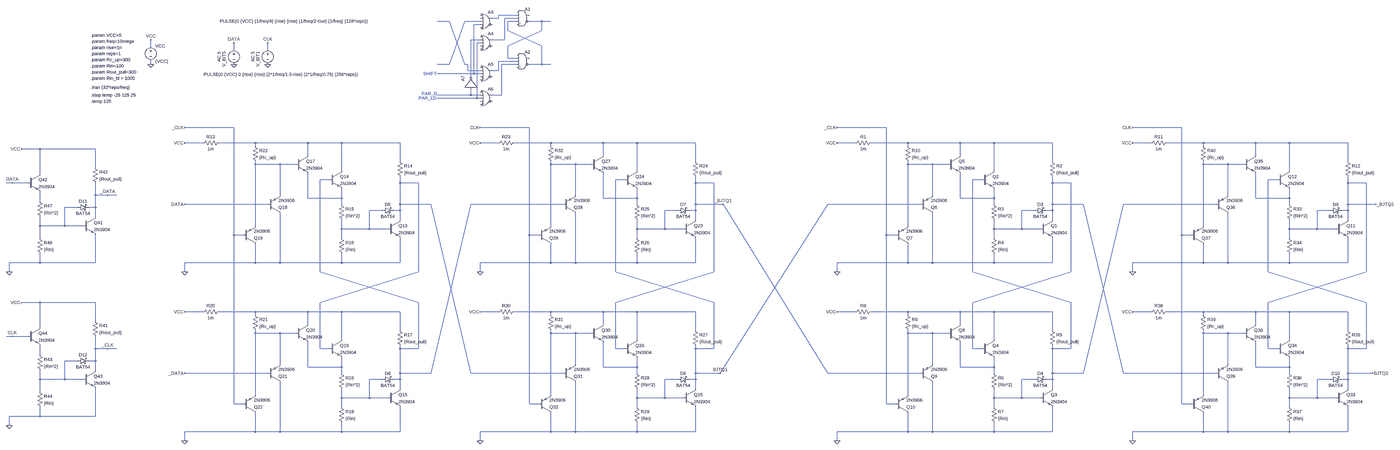
[diagram p0: schematic d_flop_bjt.asc, whole sheet]
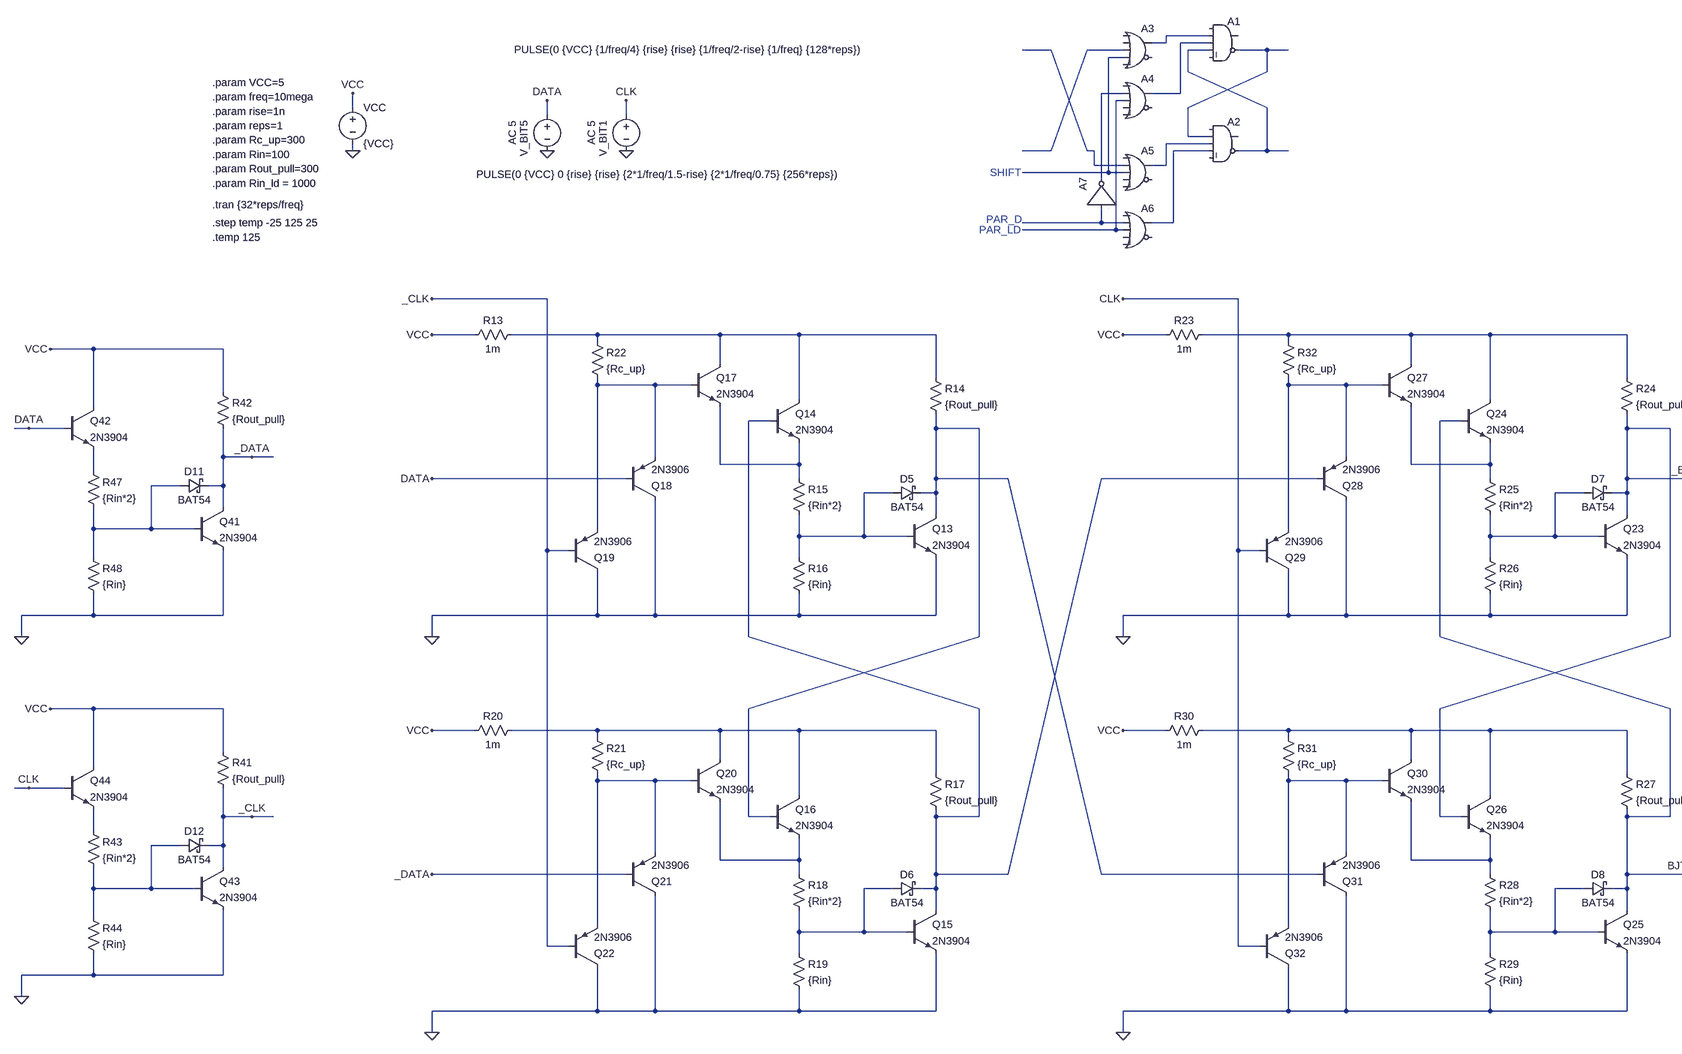
[diagram p1: schematic d_flop_bjt.asc, part, row 1 of 1, column 1 of 2]
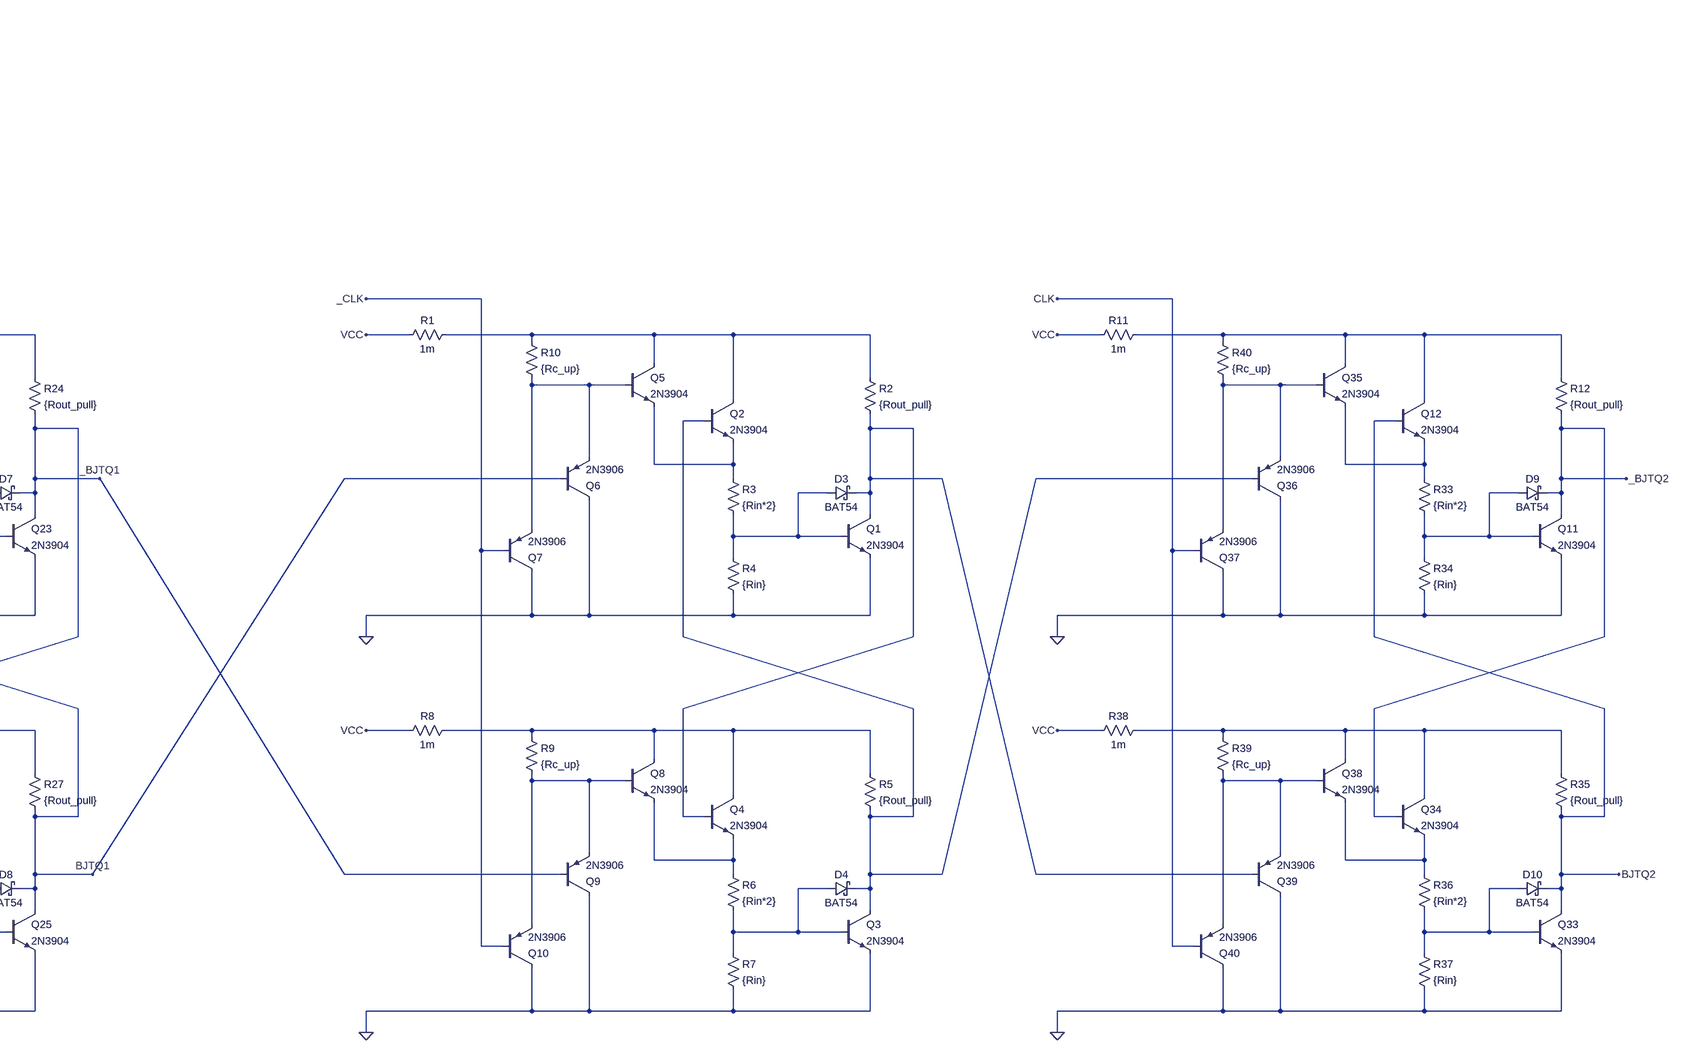
[diagram p2: schematic d_flop_bjt.asc, part, row 1 of 1, column 2 of 2]
d_flop_bjt.asc, the LTspice schematic file:
Version 4
SHEET 1 37460 9492
WIRE -480 5904 -576 5904
WIRE -576 5920 -576 5904
WIRE -576 5920 -608 5920
WIRE -480 5920 -544 5920
WIRE -832 5936 -896 5936
WIRE -672 5936 -752 5936
WIRE -480 5936 -528 5936
WIRE -352 5936 -416 5936
WIRE -304 5936 -352 5936
WIRE -672 5952 -704 5952
WIRE -528 5984 -528 5936
WIRE -352 5984 -352 5936
WIRE -672 6032 -720 6032
WIRE -544 6032 -544 5920
WIRE -544 6032 -608 6032
WIRE -672 6048 -688 6048
WIRE -2384 6064 -2384 6032
WIRE -528 6064 -352 5984
WIRE -352 6064 -528 5984
WIRE -1952 6080 -1952 6048
WIRE -1776 6080 -1776 6048
WIRE -528 6128 -528 6064
WIRE -480 6128 -528 6128
WIRE -480 6144 -576 6144
WIRE -2384 6160 -2384 6144
WIRE -832 6160 -752 5936
WIRE -832 6160 -896 6160
WIRE -752 6160 -832 5936
WIRE -736 6160 -752 6160
WIRE -480 6160 -560 6160
WIRE -352 6160 -352 6064
WIRE -352 6160 -416 6160
WIRE -304 6160 -352 6160
WIRE -736 6192 -736 6160
WIRE -672 6192 -736 6192
WIRE -576 6192 -576 6144
WIRE -576 6192 -608 6192
WIRE -704 6208 -704 5952
WIRE -704 6208 -896 6208
WIRE -672 6208 -704 6208
WIRE -720 6224 -720 6032
WIRE -720 6320 -720 6288
WIRE -720 6320 -896 6320
WIRE -672 6320 -720 6320
WIRE -560 6320 -560 6160
WIRE -560 6320 -608 6320
WIRE -688 6336 -688 6048
WIRE -688 6336 -896 6336
WIRE -672 6336 -688 6336
WIRE -1952 6784 -2208 6784
WIRE -416 6784 -672 6784
WIRE 1440 6784 1184 6784
WIRE 2976 6784 2720 6784
WIRE -2112 6864 -2208 6864
WIRE -1840 6864 -2032 6864
WIRE -1568 6864 -1840 6864
WIRE -1392 6864 -1568 6864
WIRE -1088 6864 -1392 6864
WIRE -576 6864 -672 6864
WIRE -304 6864 -496 6864
WIRE -32 6864 -304 6864
WIRE 144 6864 -32 6864
WIRE 448 6864 144 6864
WIRE 1280 6864 1184 6864
WIRE 1552 6864 1360 6864
WIRE 1824 6864 1552 6864
WIRE 2000 6864 1824 6864
WIRE 2304 6864 2000 6864
WIRE 2816 6864 2720 6864
WIRE 3088 6864 2896 6864
WIRE 3360 6864 3088 6864
WIRE 3536 6864 3360 6864
WIRE 3840 6864 3536 6864
WIRE -1840 6880 -1840 6864
WIRE -304 6880 -304 6864
WIRE 1552 6880 1552 6864
WIRE 3088 6880 3088 6864
WIRE -2960 6896 -3056 6896
WIRE -2672 6896 -2960 6896
WIRE -1568 6928 -1568 6864
WIRE -32 6928 -32 6864
WIRE 1824 6928 1824 6864
WIRE 3360 6928 3360 6864
WIRE -1088 6960 -1088 6864
WIRE 448 6960 448 6864
WIRE 2304 6960 2304 6864
WIRE 3840 6960 3840 6864
WIRE -1840 6976 -1840 6960
WIRE -1712 6976 -1840 6976
WIRE -1632 6976 -1712 6976
WIRE -304 6976 -304 6960
WIRE -176 6976 -304 6976
WIRE -96 6976 -176 6976
WIRE 1552 6976 1552 6960
WIRE 1680 6976 1552 6976
WIRE 1760 6976 1680 6976
WIRE 3088 6976 3088 6960
WIRE 3216 6976 3088 6976
WIRE 3296 6976 3216 6976
WIRE -2672 6992 -2672 6896
WIRE -1392 7008 -1392 6864
WIRE 144 7008 144 6864
WIRE 2000 7008 2000 6864
WIRE 3536 7008 3536 6864
WIRE -2960 7024 -2960 6896
WIRE -1456 7056 -1504 7056
WIRE 80 7056 32 7056
WIRE 1936 7056 1888 7056
WIRE 3472 7056 3424 7056
WIRE -3104 7072 -3136 7072
WIRE -3024 7072 -3104 7072
WIRE -1088 7072 -1088 7040
WIRE -992 7072 -1088 7072
WIRE 448 7072 448 7040
WIRE 544 7072 448 7072
WIRE 2304 7072 2304 7040
WIRE 2400 7072 2304 7072
WIRE 3840 7072 3840 7040
WIRE 3936 7072 3840 7072
WIRE -2672 7136 -2672 7072
WIRE -2608 7136 -2672 7136
WIRE -2560 7136 -2608 7136
WIRE -1712 7136 -1712 6976
WIRE -176 7136 -176 6976
WIRE 1680 7136 1680 6976
WIRE 3216 7136 3216 6976
WIRE -1568 7152 -1568 7024
WIRE -1392 7152 -1392 7104
WIRE -1392 7152 -1568 7152
WIRE -32 7152 -32 7024
WIRE 144 7152 144 7104
WIRE 144 7152 -32 7152
WIRE 1824 7152 1824 7024
WIRE 2000 7152 2000 7104
WIRE 2000 7152 1824 7152
WIRE 3360 7152 3360 7024
WIRE 3536 7152 3536 7104
WIRE 3536 7152 3360 7152
WIRE -2960 7168 -2960 7120
WIRE -1776 7184 -2208 7184
WIRE -1392 7184 -1392 7152
WIRE -1088 7184 -1088 7072
WIRE -928 7184 -1088 7184
WIRE -240 7184 -720 7184
WIRE 144 7184 144 7152
WIRE 448 7184 448 7072
WIRE 592 7184 448 7184
WIRE 1616 7184 1136 7184
WIRE 2000 7184 2000 7152
WIRE 2304 7184 2304 7072
WIRE 2464 7184 2304 7184
WIRE 3152 7184 2672 7184
WIRE 3536 7184 3536 7152
WIRE 3840 7184 3840 7072
WIRE 3984 7184 3840 7184
WIRE -2768 7200 -2832 7200
WIRE -2672 7200 -2672 7136
WIRE -2672 7200 -2704 7200
WIRE -1184 7216 -1248 7216
WIRE -1088 7216 -1088 7184
WIRE -1088 7216 -1120 7216
WIRE 352 7216 288 7216
WIRE 448 7216 448 7184
WIRE 448 7216 416 7216
WIRE 2208 7216 2144 7216
WIRE 2304 7216 2304 7184
WIRE 2304 7216 2272 7216
WIRE 3744 7216 3680 7216
WIRE 3840 7216 3840 7184
WIRE 3840 7216 3808 7216
WIRE -2672 7248 -2672 7200
WIRE -1088 7264 -1088 7216
WIRE 448 7264 448 7216
WIRE 2304 7264 2304 7216
WIRE 3840 7264 3840 7216
WIRE -2960 7296 -2960 7248
WIRE -2832 7296 -2832 7200
WIRE -2832 7296 -2960 7296
WIRE -2736 7296 -2832 7296
WIRE -1840 7296 -1840 6976
WIRE -304 7296 -304 6976
WIRE 1552 7296 1552 6976
WIRE 3088 7296 3088 6976
WIRE -1392 7312 -1392 7264
WIRE -1248 7312 -1248 7216
WIRE -1248 7312 -1392 7312
WIRE -1152 7312 -1248 7312
WIRE 144 7312 144 7264
WIRE 288 7312 288 7216
WIRE 288 7312 144 7312
WIRE 384 7312 288 7312
WIRE 2000 7312 2000 7264
WIRE 2144 7312 2144 7216
WIRE 2144 7312 2000 7312
WIRE 2240 7312 2144 7312
WIRE 3536 7312 3536 7264
WIRE 3680 7312 3680 7216
WIRE 3680 7312 3536 7312
WIRE 3776 7312 3680 7312
WIRE -1952 7344 -1952 6784
WIRE -1904 7344 -1952 7344
WIRE -416 7344 -416 6784
WIRE -368 7344 -416 7344
WIRE 1440 7344 1440 6784
WIRE 1488 7344 1440 7344
WIRE 2976 7344 2976 6784
WIRE 3024 7344 2976 7344
WIRE -2960 7360 -2960 7296
WIRE -1392 7360 -1392 7312
WIRE 144 7360 144 7312
WIRE 2000 7360 2000 7312
WIRE 3536 7360 3536 7312
WIRE -2960 7488 -2960 7440
WIRE -2960 7488 -3120 7488
WIRE -2672 7488 -2672 7344
WIRE -2672 7488 -2960 7488
WIRE -1840 7488 -1840 7392
WIRE -1840 7488 -2208 7488
WIRE -1712 7488 -1712 7232
WIRE -1712 7488 -1840 7488
WIRE -1392 7488 -1392 7440
WIRE -1392 7488 -1712 7488
WIRE -1088 7488 -1088 7360
WIRE -1088 7488 -1392 7488
WIRE -304 7488 -304 7392
WIRE -304 7488 -672 7488
WIRE -176 7488 -176 7232
WIRE -176 7488 -304 7488
WIRE 144 7488 144 7440
WIRE 144 7488 -176 7488
WIRE 448 7488 448 7360
WIRE 448 7488 144 7488
WIRE 1552 7488 1552 7392
WIRE 1552 7488 1184 7488
WIRE 1680 7488 1680 7232
WIRE 1680 7488 1552 7488
WIRE 2000 7488 2000 7440
WIRE 2000 7488 1680 7488
WIRE 2304 7488 2304 7360
WIRE 2304 7488 2000 7488
WIRE 3088 7488 3088 7392
WIRE 3088 7488 2720 7488
WIRE 3216 7488 3216 7232
WIRE 3216 7488 3088 7488
WIRE 3536 7488 3536 7440
WIRE 3536 7488 3216 7488
WIRE 3840 7488 3840 7360
WIRE 3840 7488 3536 7488
WIRE -3120 7536 -3120 7488
WIRE -2208 7536 -2208 7488
WIRE -1504 7536 -1504 7056
WIRE -992 7536 -992 7072
WIRE -672 7536 -672 7488
WIRE 32 7536 32 7056
WIRE 544 7536 544 7072
WIRE 1184 7536 1184 7488
WIRE 1888 7536 1888 7056
WIRE 2400 7536 2400 7072
WIRE 2720 7536 2720 7488
WIRE 3424 7536 3424 7056
WIRE 3936 7536 3936 7072
WIRE -2960 7696 -3056 7696
WIRE -2672 7696 -2960 7696
WIRE -1504 7696 -992 7536
WIRE -992 7696 -1504 7536
WIRE 32 7696 544 7536
WIRE 544 7696 32 7536
WIRE 1888 7696 2400 7536
WIRE 2400 7696 1888 7536
WIRE 3424 7696 3936 7536
WIRE 3936 7696 3424 7536
WIRE -2112 7744 -2208 7744
WIRE -1840 7744 -2032 7744
WIRE -1568 7744 -1840 7744
WIRE -1392 7744 -1568 7744
WIRE -1088 7744 -1392 7744
WIRE -576 7744 -672 7744
WIRE -304 7744 -496 7744
WIRE -32 7744 -304 7744
WIRE 144 7744 -32 7744
WIRE 448 7744 144 7744
WIRE 1280 7744 1184 7744
WIRE 1552 7744 1360 7744
WIRE 1824 7744 1552 7744
WIRE 2000 7744 1824 7744
WIRE 2304 7744 2000 7744
WIRE 2816 7744 2720 7744
WIRE 3088 7744 2896 7744
WIRE 3360 7744 3088 7744
WIRE 3536 7744 3360 7744
WIRE 3840 7744 3536 7744
WIRE -1840 7760 -1840 7744
WIRE -304 7760 -304 7744
WIRE 1552 7760 1552 7744
WIRE 3088 7760 3088 7744
WIRE -2672 7792 -2672 7696
WIRE -1568 7808 -1568 7744
WIRE -32 7808 -32 7744
WIRE 1824 7808 1824 7744
WIRE 3360 7808 3360 7744
WIRE -2960 7824 -2960 7696
WIRE -1088 7840 -1088 7744
WIRE 448 7840 448 7744
WIRE 2304 7840 2304 7744
WIRE 3840 7840 3840 7744
WIRE -1840 7856 -1840 7840
WIRE -1712 7856 -1840 7856
WIRE -1632 7856 -1712 7856
WIRE -304 7856 -304 7840
WIRE -176 7856 -304 7856
WIRE -96 7856 -176 7856
WIRE 1552 7856 1552 7840
WIRE 1680 7856 1552 7856
WIRE 1760 7856 1680 7856
WIRE 3088 7856 3088 7840
WIRE 3216 7856 3088 7856
WIRE 3296 7856 3216 7856
WIRE -3104 7872 -3136 7872
WIRE -3024 7872 -3104 7872
WIRE -1392 7888 -1392 7744
WIRE 144 7888 144 7744
WIRE 2000 7888 2000 7744
WIRE 3536 7888 3536 7744
WIRE -2672 7936 -2672 7872
WIRE -2608 7936 -2672 7936
WIRE -2560 7936 -2608 7936
WIRE -1504 7936 -1504 7696
WIRE -1456 7936 -1504 7936
WIRE -1088 7936 -1088 7920
WIRE -992 7936 -992 7696
WIRE -992 7936 -1088 7936
WIRE 32 7936 32 7696
WIRE 80 7936 32 7936
WIRE 448 7936 448 7920
WIRE 544 7936 544 7696
WIRE 544 7936 448 7936
WIRE 1888 7936 1888 7696
WIRE 1936 7936 1888 7936
WIRE 2304 7936 2304 7920
WIRE 2400 7936 2400 7696
WIRE 2400 7936 2304 7936
WIRE 3424 7936 3424 7696
WIRE 3472 7936 3424 7936
WIRE 3840 7936 3840 7920
WIRE 3936 7936 3936 7696
WIRE 3936 7936 3840 7936
WIRE -2960 7968 -2960 7920
WIRE -2768 8000 -2832 8000
WIRE -2672 8000 -2672 7936
WIRE -2672 8000 -2704 8000
WIRE -1712 8016 -1712 7856
WIRE -176 8016 -176 7856
WIRE 1680 8016 1680 7856
WIRE 3216 8016 3216 7856
WIRE -1568 8032 -1568 7904
WIRE -1392 8032 -1392 7984
WIRE -1392 8032 -1568 8032
WIRE -32 8032 -32 7904
WIRE 144 8032 144 7984
WIRE 144 8032 -32 8032
WIRE 1824 8032 1824 7904
WIRE 2000 8032 2000 7984
WIRE 2000 8032 1824 8032
WIRE 3360 8032 3360 7904
WIRE 3536 8032 3536 7984
WIRE 3536 8032 3360 8032
WIRE -2672 8048 -2672 8000
WIRE -1776 8064 -2208 8064
WIRE -1392 8064 -1392 8032
WIRE -1088 8064 -1088 7936
WIRE -928 8064 -720 7184
WIRE -928 8064 -1088 8064
WIRE -720 8064 -928 7184
WIRE -240 8064 -720 8064
WIRE 144 8064 144 8032
WIRE 448 8064 448 7936
WIRE 576 8064 1136 7184
WIRE 576 8064 448 8064
WIRE 1136 8064 592 7184
WIRE 1616 8064 1136 8064
WIRE 2000 8064 2000 8032
WIRE 2304 8064 2304 7936
WIRE 2464 8064 2672 7184
WIRE 2464 8064 2304 8064
WIRE 2672 8064 2464 7184
WIRE 3152 8064 2672 8064
WIRE 3536 8064 3536 8032
WIRE 3840 8064 3840 7936
WIRE 3968 8064 3840 8064
WIRE -2960 8096 -2960 8048
WIRE -2832 8096 -2832 8000
WIRE -2832 8096 -2960 8096
WIRE -2736 8096 -2832 8096
WIRE -1184 8096 -1248 8096
WIRE -1088 8096 -1088 8064
WIRE -1088 8096 -1120 8096
WIRE 352 8096 288 8096
WIRE 448 8096 448 8064
WIRE 448 8096 416 8096
WIRE 2208 8096 2144 8096
WIRE 2304 8096 2304 8064
WIRE 2304 8096 2272 8096
WIRE 3744 8096 3680 8096
WIRE 3840 8096 3840 8064
WIRE 3840 8096 3808 8096
WIRE -1088 8144 -1088 8096
WIRE 448 8144 448 8096
WIRE 2304 8144 2304 8096
WIRE 3840 8144 3840 8096
WIRE -2960 8160 -2960 8096
WIRE -1840 8176 -1840 7856
WIRE -304 8176 -304 7856
WIRE 1552 8176 1552 7856
WIRE 3088 8176 3088 7856
WIRE -1392 8192 -1392 8144
WIRE -1248 8192 -1248 8096
WIRE -1248 8192 -1392 8192
WIRE -1152 8192 -1248 8192
WIRE 144 8192 144 8144
WIRE 288 8192 288 8096
WIRE 288 8192 144 8192
WIRE 384 8192 288 8192
WIRE 2000 8192 2000 8144
WIRE 2144 8192 2144 8096
WIRE 2144 8192 2000 8192
WIRE 2240 8192 2144 8192
WIRE 3536 8192 3536 8144
WIRE 3680 8192 3680 8096
WIRE 3680 8192 3536 8192
WIRE 3776 8192 3680 8192
WIRE -1952 8224 -1952 7344
WIRE -1904 8224 -1952 8224
WIRE -416 8224 -416 7344
WIRE -368 8224 -416 8224
WIRE 1440 8224 1440 7344
WIRE 1488 8224 1440 8224
WIRE 2976 8224 2976 7344
WIRE 3024 8224 2976 8224
WIRE -1392 8240 -1392 8192
WIRE 144 8240 144 8192
WIRE 2000 8240 2000 8192
WIRE 3536 8240 3536 8192
WIRE -2960 8288 -2960 8240
WIRE -2960 8288 -3120 8288
WIRE -2672 8288 -2672 8144
WIRE -2672 8288 -2960 8288
WIRE -3120 8336 -3120 8288
WIRE -1840 8368 -1840 8272
WIRE -1840 8368 -2208 8368
WIRE -1712 8368 -1712 8112
WIRE -1712 8368 -1840 8368
WIRE -1392 8368 -1392 8320
WIRE -1392 8368 -1712 8368
WIRE -1088 8368 -1088 8240
WIRE -1088 8368 -1392 8368
WIRE -304 8368 -304 8272
WIRE -304 8368 -672 8368
WIRE -176 8368 -176 8112
WIRE -176 8368 -304 8368
WIRE 144 8368 144 8320
WIRE 144 8368 -176 8368
WIRE 448 8368 448 8240
WIRE 448 8368 144 8368
WIRE 1552 8368 1552 8272
WIRE 1552 8368 1184 8368
WIRE 1680 8368 1680 8112
WIRE 1680 8368 1552 8368
WIRE 2000 8368 2000 8320
WIRE 2000 8368 1680 8368
WIRE 2304 8368 2304 8240
WIRE 2304 8368 2000 8368
WIRE 3088 8368 3088 8272
WIRE 3088 8368 2720 8368
WIRE 3216 8368 3216 8112
WIRE 3216 8368 3088 8368
WIRE 3536 8368 3536 8320
WIRE 3536 8368 3216 8368
WIRE 3840 8368 3840 8240
WIRE 3840 8368 3536 8368
WIRE -2208 8416 -2208 8368
WIRE -672 8416 -672 8368
WIRE 1184 8416 1184 8368
WIRE 2720 8416 2720 8368
FLAG -2384 6160 0
FLAG -2384 6032 VCC
FLAG -1952 6160 0
FLAG -1952 6048 DATA
FLAG -1776 6160 0
FLAG -1776 6048 CLK
FLAG -2208 7536 0
FLAG -2208 6864 VCC
FLAG -2208 8416 0
FLAG -2208 7744 VCC
FLAG -2208 8064 _DATA
FLAG -2208 7184 DATA
FLAG -2208 6784 _CLK
FLAG -672 7536 0
FLAG -672 6864 VCC
FLAG -672 8416 0
FLAG -672 7744 VCC
FLAG -672 6784 CLK
FLAG 576 8064 BJTQ1
FLAG 592 7184 _BJTQ1
FLAG 1184 7536 0
FLAG 1184 6864 VCC
FLAG 1184 8416 0
FLAG 1184 7744 VCC
FLAG 1184 6784 _CLK
FLAG 2720 7536 0
FLAG 2720 6864 VCC
FLAG 2720 8416 0
FLAG 2720 7744 VCC
FLAG 2720 6784 CLK
FLAG 3968 8064 BJTQ2
FLAG 3984 7184 _BJTQ2
FLAG -3120 7536 0
FLAG -3104 7072 DATA
FLAG -3056 6896 VCC
FLAG -2608 7136 _DATA
FLAG -3120 8336 0
FLAG -3104 7872 CLK
FLAG -3056 7696 VCC
FLAG -2608 7936 _CLK
SYMBOL voltage -2384 6048 R0
WINDOW 123 0 0 Left 0
WINDOW 39 0 0 Left 0
SYMATTR InstName VCC
SYMATTR Value {VCC}
SYMBOL voltage -1952 6064 R0
WINDOW 123 -77 30 VRight 2
WINDOW 39 0 0 Left 0
WINDOW 0 -51 28 VRight 2
WINDOW 3 647 148 Right 2
SYMATTR Value2 AC 5
SYMATTR InstName V_BIT5
SYMATTR Value PULSE(0 {VCC} 0 {rise} {rise} {2*1/freq/1.5-rise} {2*1/freq/0.75} {256*reps})
SYMBOL Digital\\and -448 5856 R0
SYMATTR InstName A1
SYMBOL Digital\\and -448 6080 R0
SYMATTR InstName A2
SYMBOL Digital\\or -640 5872 R0
SYMATTR InstName A3
SYMBOL Digital\\or -640 5984 R0
SYMATTR InstName A4
SYMBOL Digital\\or -640 6144 R0
SYMATTR InstName A5
SYMBOL Digital\\or -640 6272 R0
SYMATTR InstName A6
SYMBOL Digital\\inv -784 6288 R270
SYMATTR InstName A7
SYMBOL voltage -1776 6064 R0
WINDOW 123 -77 30 VRight 2
WINDOW 39 0 0 Left 0
WINDOW 0 -51 28 VRight 2
WINDOW 3 521 -129 Right 2
SYMATTR Value2 AC 5
SYMATTR InstName V_BIT1
SYMATTR Value PULSE(0 {VCC} {1/freq/4} {rise} {rise} {1/freq/2-rise} {1/freq} {128*reps})
SYMBOL npn -1152 7264 R0
SYMATTR InstName Q13
SYMATTR Value 2N3904
SYMBOL schottky -1184 7232 R270
WINDOW 0 32 32 VTop 2
WINDOW 3 0 32 VBottom 2
SYMATTR InstName D5
SYMATTR Value BAT54
SYMATTR Description Diode
SYMATTR Type diode
SYMBOL res -2128 6880 R270
WINDOW 0 32 56 VTop 2
WINDOW 3 0 56 VBottom 2
SYMATTR InstName R13
SYMATTR Value 1m
SYMBOL npn -1456 7008 R0
SYMATTR InstName Q14
SYMATTR Value 2N3904
SYMBOL res -1104 6944 R0
SYMATTR InstName R14
SYMATTR Value {Rout_pull}
SYMBOL res -1408 7168 R0
SYMATTR InstName R15
SYMATTR Value {Rin*2}
SYMBOL res -1408 7344 R0
SYMATTR InstName R16
SYMATTR Value {Rin}
SYMBOL npn -1152 8144 R0
SYMATTR InstName Q15
SYMATTR Value 2N3904
SYMBOL schottky -1184 8112 R270
WINDOW 0 32 32 VTop 2
WINDOW 3 0 32 VBottom 2
SYMATTR InstName D6
SYMATTR Value BAT54
SYMATTR Description Diode
SYMATTR Type diode
SYMBOL npn -1456 7888 R0
SYMATTR InstName Q16
SYMATTR Value 2N3904
SYMBOL res -1104 7824 R0
SYMATTR InstName R17
SYMATTR Value {Rout_pull}
SYMBOL res -1408 8048 R0
SYMATTR InstName R18
SYMATTR Value {Rin*2}
SYMBOL res -1408 8224 R0
SYMATTR InstName R19
SYMATTR Value {Rin}
SYMBOL npn -1632 6928 R0
SYMATTR InstName Q17
SYMATTR Value 2N3904
SYMBOL pnp -1776 7232 M180
SYMATTR InstName Q18
SYMATTR Value 2N3906
SYMBOL pnp -1904 7392 M180
SYMATTR InstName Q19
SYMATTR Value 2N3906
SYMBOL res -2128 7760 R270
WINDOW 0 32 56 VTop 2
WINDOW 3 0 56 VBottom 2
SYMATTR InstName R20
SYMATTR Value 1m
SYMBOL npn -1632 7808 R0
SYMATTR InstName Q20
SYMATTR Value 2N3904
SYMBOL pnp -1776 8112 M180
SYMATTR InstName Q21
SYMATTR Value 2N3906
SYMBOL pnp -1904 8272 M180
SYMATTR InstName Q22
SYMATTR Value 2N3906
SYMBOL res -1856 7744 R0
SYMATTR InstName R21
SYMATTR Value {Rc_up}
SYMBOL res -1856 6864 R0
SYMATTR InstName R22
SYMATTR Value {Rc_up}
SYMBOL npn 384 7264 R0
SYMATTR InstName Q23
SYMATTR Value 2N3904
SYMBOL schottky 352 7232 R270
WINDOW 0 32 32 VTop 2
WINDOW 3 0 32 VBottom 2
SYMATTR InstName D7
SYMATTR Value BAT54
SYMATTR Description Diode
SYMATTR Type diode
SYMBOL res -592 6880 R270
WINDOW 0 32 56 VTop 2
WINDOW 3 0 56 VBottom 2
SYMATTR InstName R23
SYMATTR Value 1m
SYMBOL npn 80 7008 R0
SYMATTR InstName Q24
SYMATTR Value 2N3904
SYMBOL res 432 6944 R0
SYMATTR InstName R24
SYMATTR Value {Rout_pull}
SYMBOL res 128 7168 R0
SYMATTR InstName R25
SYMATTR Value {Rin*2}
SYMBOL res 128 7344 R0
SYMATTR InstName R26
SYMATTR Value {Rin}
SYMBOL npn 384 8144 R0
SYMATTR InstName Q25
SYMATTR Value 2N3904
SYMBOL schottky 352 8112 R270
WINDOW 0 32 32 VTop 2
WINDOW 3 0 32 VBottom 2
SYMATTR InstName D8
SYMATTR Value BAT54
SYMATTR Description Diode
SYMATTR Type diode
SYMBOL npn 80 7888 R0
SYMATTR InstName Q26
SYMATTR Value 2N3904
SYMBOL res 432 7824 R0
SYMATTR InstName R27
SYMATTR Value {Rout_pull}
SYMBOL res 128 8048 R0
SYMATTR InstName R28
SYMATTR Value {Rin*2}
SYMBOL res 128 8224 R0
SYMATTR InstName R29
SYMATTR Value {Rin}
SYMBOL npn -96 6928 R0
SYMATTR InstName Q27
SYMATTR Value 2N3904
SYMBOL pnp -240 7232 M180
SYMATTR InstName Q28
SYMATTR Value 2N3906
SYMBOL pnp -368 7392 M180
SYMATTR InstName Q29
SYMATTR Value 2N3906
SYMBOL res -592 7760 R270
WINDOW 0 32 56 VTop 2
WINDOW 3 0 56 VBottom 2
SYMATTR InstName R30
SYMATTR Value 1m
SYMBOL npn -96 7808 R0
SYMATTR InstName Q30
SYMATTR Value 2N3904
SYMBOL pnp -240 8112 M180
SYMATTR InstName Q31
SYMATTR Value 2N3906
SYMBOL pnp -368 8272 M180
SYMATTR InstName Q32
SYMATTR Value 2N3906
SYMBOL res -320 7744 R0
SYMATTR InstName R31
SYMATTR Value {Rc_up}
SYMBOL res -320 6864 R0
SYMATTR InstName R32
SYMATTR Value {Rc_up}
SYMBOL npn 2240 7264 R0
SYMATTR InstName Q1
SYMATTR Value 2N3904
SYMBOL schottky 2208 7232 R270
WINDOW 0 32 32 VTop 2
WINDOW 3 0 32 VBottom 2
SYMATTR InstName D3
SYMATTR Value BAT54
SYMATTR Description Diode
SYMATTR Type diode
SYMBOL res 1264 6880 R270
WINDOW 0 32 56 VTop 2
WINDOW 3 0 56 VBottom 2
SYMATTR InstName R1
SYMATTR Value 1m
SYMBOL npn 1936 7008 R0
SYMATTR InstName Q2
SYMATTR Value 2N3904
SYMBOL res 2288 6944 R0
SYMATTR InstName R2
SYMATTR Value {Rout_pull}
SYMBOL res 1984 7168 R0
SYMATTR InstName R3
SYMATTR Value {Rin*2}
SYMBOL res 1984 7344 R0
SYMATTR InstName R4
SYMATTR Value {Rin}
SYMBOL npn 2240 8144 R0
SYMATTR InstName Q3
SYMATTR Value 2N3904
SYMBOL schottky 2208 8112 R270
WINDOW 0 32 32 VTop 2
WINDOW 3 0 32 VBottom 2
SYMATTR InstName D4
SYMATTR Value BAT54
SYMATTR Description Diode
SYMATTR Type diode
SYMBOL npn 1936 7888 R0
SYMATTR InstName Q4
SYMATTR Value 2N3904
SYMBOL res 2288 7824 R0
SYMATTR InstName R5
SYMATTR Value {Rout_pull}
SYMBOL res 1984 8048 R0
SYMATTR InstName R6
SYMATTR Value {Rin*2}
SYMBOL res 1984 8224 R0
SYMATTR InstName R7
SYMATTR Value {Rin}
SYMBOL npn 1760 6928 R0
SYMATTR InstName Q5
SYMATTR Value 2N3904
SYMBOL pnp 1616 7232 M180
SYMATTR InstName Q6
SYMATTR Value 2N3906
SYMBOL pnp 1488 7392 M180
SYMATTR InstName Q7
SYMATTR Value 2N3906
SYMBOL res 1264 7760 R270
WINDOW 0 32 56 VTop 2
WINDOW 3 0 56 VBottom 2
SYMATTR InstName R8
SYMATTR Value 1m
SYMBOL npn 1760 7808 R0
SYMATTR InstName Q8
SYMATTR Value 2N3904
SYMBOL pnp 1616 8112 M180
SYMATTR InstName Q9
SYMATTR Value 2N3906
SYMBOL pnp 1488 8272 M180
SYMATTR InstName Q10
SYMATTR Value 2N3906
SYMBOL res 1536 7744 R0
SYMATTR InstName R9
SYMATTR Value {Rc_up}
SYMBOL res 1536 6864 R0
SYMATTR InstName R10
SYMATTR Value {Rc_up}
SYMBOL npn 3776 7264 R0
SYMATTR InstName Q11
SYMATTR Value 2N3904
SYMBOL schottky 3744 7232 R270
WINDOW 0 32 32 VTop 2
WINDOW 3 0 32 VBottom 2
SYMATTR InstName D9
SYMATTR Value BAT54
SYMATTR Description Diode
SYMATTR Type diode
SYMBOL res 2800 6880 R270
WINDOW 0 32 56 VTop 2
WINDOW 3 0 56 VBottom 2
SYMATTR InstName R11
SYMATTR Value 1m
SYMBOL npn 3472 7008 R0
SYMATTR InstName Q12
SYMATTR Value 2N3904
SYMBOL res 3824 6944 R0
SYMATTR InstName R12
SYMATTR Value {Rout_pull}
SYMBOL res 3520 7168 R0
SYMATTR InstName R33
SYMATTR Value {Rin*2}
SYMBOL res 3520 7344 R0
SYMATTR InstName R34
SYMATTR Value {Rin}
SYMBOL npn 3776 8144 R0
SYMATTR InstName Q33
SYMATTR Value 2N3904
SYMBOL schottky 3744 8112 R270
WINDOW 0 32 32 VTop 2
WINDOW 3 0 32 VBottom 2
SYMATTR InstName D10
SYMATTR Value BAT54
SYMATTR Description Diode
SYMATTR Type diode
SYMBOL npn 3472 7888 R0
SYMATTR InstName Q34
SYMATTR Value 2N3904
SYMBOL res 3824 7824 R0
SYMATTR InstName R35
SYMATTR Value {Rout_pull}
SYMBOL res 3520 8048 R0
SYMATTR InstName R36
SYMATTR Value {Rin*2}
SYMBOL res 3520 8224 R0
SYMATTR InstName R37
SYMATTR Value {Rin}
SYMBOL npn 3296 6928 R0
SYMATTR InstName Q35
SYMATTR Value 2N3904
SYMBOL pnp 3152 7232 M180
SYMATTR InstName Q36
SYMATTR Value 2N3906
SYMBOL pnp 3024 7392 M180
SYMATTR InstName Q37
SYMATTR Value 2N3906
SYMBOL res 2800 7760 R270
WINDOW 0 32 56 VTop 2
WINDOW 3 0 56 VBottom 2
SYMATTR InstName R38
SYMATTR Value 1m
SYMBOL npn 3296 7808 R0
SYMATTR InstName Q38
SYMATTR Value 2N3904
SYMBOL pnp 3152 8112 M180
SYMATTR InstName Q39
SYMATTR Value 2N3906
SYMBOL pnp 3024 8272 M180
SYMATTR InstName Q40
SYMATTR Value 2N3906
SYMBOL res 3072 7744 R0
SYMATTR InstName R39
SYMATTR Value {Rc_up}
SYMBOL res 3072 6864 R0
SYMATTR InstName R40
SYMATTR Value {Rc_up}
SYMBOL npn -2736 7248 R0
SYMATTR InstName Q41
SYMATTR Value 2N3904
SYMBOL schottky -2768 7216 R270
WINDOW 0 32 32 VTop 2
WINDOW 3 0 32 VBottom 2
SYMATTR InstName D11
SYMATTR Value BAT54
SYMATTR Description Diode
SYMATTR Type diode
SYMBOL res -2688 6976 R0
SYMATTR InstName R42
SYMATTR Value {Rout_pull}
SYMBOL npn -3024 7024 R0
SYMATTR InstName Q42
SYMATTR Value 2N3904
SYMBOL res -2976 7152 R0
SYMATTR InstName R47
SYMATTR Value {Rin*2}
SYMBOL res -2976 7344 R0
SYMATTR InstName R48
SYMATTR Value {Rin}
SYMBOL npn -2736 8048 R0
SYMATTR InstName Q43
SYMATTR Value 2N3904
SYMBOL schottky -2768 8016 R270
WINDOW 0 32 32 VTop 2
WINDOW 3 0 32 VBottom 2
SYMATTR InstName D12
SYMATTR Value BAT54
SYMATTR Description Diode
SYMATTR Type diode
SYMBOL res -2688 7776 R0
SYMATTR InstName R41
SYMATTR Value {Rout_pull}
SYMBOL npn -3024 7824 R0
SYMATTR InstName Q44
SYMATTR Value 2N3904
SYMBOL res -2976 7952 R0
SYMATTR InstName R43
SYMATTR Value {Rin*2}
SYMBOL res -2976 8144 R0
SYMATTR InstName R44
SYMATTR Value {Rin}
TEXT -2696 6280 Left 2 !.tran {32*reps/freq}
TEXT -2696 6008 Left 2 !.param VCC=5
TEXT -2696 6040 Left 2 !.param freq=10mega
TEXT -2696 6072 Left 2 !.param rise=1n
TEXT -2696 6104 Left 2 !.param reps=1
TEXT -992 6336 Left 2 ;PAR_LD
TEXT -976 6312 Left 2 ;PAR_D
TEXT -968 6208 Left 2 ;SHIFT
TEXT -2696 6168 Left 2 !.param Rin=100
TEXT -2696 6200 Left 2 !.param Rout_pull=300
TEXT -2696 6232 Left 2 !.param Rin_ld = 1000
TEXT -2696 6136 Left 2 !.param Rc_up=300
TEXT -2696 6320 Left 2 !.step temp -25 125 25
TEXT -2696 6352 Left 2 !.temp 125

The netlist it stands for:
* d_flop_bjt.asc
VCC VCC 0 {VCC}
V_BIT5 DATA 0 PULSE(0 {VCC} 0 {rise} {rise} {2*1/freq/1.5-rise} {2*1/freq/0.75} {256*reps}) AC 5
A1 0 N001 N002 N005 0 N006 0 0 AND
A2 0 N006 N010 N011 0 N005 0 0 AND
A3 0 0 N004 N007 0 0 N001 0 OR
A4 0 N008 N009 0 0 0 N002 0 OR
A5 0 N003 N007 0 0 0 N010 0 OR
A6 0 N012 N009 0 0 0 N011 0 OR
A7 N012 0 0 0 0 N008 0 0 BUF
V_BIT1 CLK 0 PULSE(0 {VCC} {1/freq/4} {rise} {rise} {1/freq/2-rise} {1/freq} {128*reps}) AC 5
Q13 N023 N031 0 0 2N3904
D5 N031 N023 BAT54
R13 VCC N013 1m
Q14 N013 N021 N025 0 2N3904
R14 N013 N023 {Rout_pull}
R15 N025 N031 {Rin*2}
R16 N031 0 {Rin}
Q15 N021 N049 0 0 2N3904
D6 N049 N021 BAT54
Q16 N035 N023 N045 0 2N3904
R17 N035 N021 {Rout_pull}
R18 N045 N049 {Rin*2}
R19 N049 0 {Rin}
Q17 N013 N017 N025 0 2N3904
Q18 0 DATA N017 0 2N3906
Q19 0 _CLK N017 0 2N3906
R20 VCC N035 1m
Q20 N035 N039 N045 0 2N3904
Q21 0 _DATA N039 0 2N3906
Q22 0 _CLK N039 0 2N3906
R21 N035 N039 {Rc_up}
R22 N013 N017 {Rc_up}
Q23 _BJTQ1 N032 0 0 2N3904
D7 N032 _BJTQ1 BAT54
R23 VCC N014 1m
Q24 N014 BJTQ1 N026 0 2N3904
R24 N014 _BJTQ1 {Rout_pull}
R25 N026 N032 {Rin*2}
R26 N032 0 {Rin}
Q25 BJTQ1 N050 0 0 2N3904
D8 N050 BJTQ1 BAT54
Q26 N036 _BJTQ1 N046 0 2N3904
R27 N036 BJTQ1 {Rout_pull}
R28 N046 N050 {Rin*2}
R29 N050 0 {Rin}
Q27 N014 N018 N026 0 2N3904
Q28 0 N021 N018 0 2N3906
Q29 0 CLK N018 0 2N3906
R30 VCC N036 1m
Q30 N036 N040 N046 0 2N3904
Q31 0 N023 N040 0 2N3906
Q32 0 CLK N040 0 2N3906
R31 N036 N040 {Rc_up}
R32 N014 N018 {Rc_up}
Q1 N024 N033 0 0 2N3904
D3 N033 N024 BAT54
R1 VCC N015 1m
Q2 N015 N022 N027 0 2N3904
R2 N015 N024 {Rout_pull}
R3 N027 N033 {Rin*2}
R4 N033 0 {Rin}
Q3 N022 N051 0 0 2N3904
D4 N051 N022 BAT54
Q4 N037 N024 N047 0 2N3904
R5 N037 N022 {Rout_pull}
R6 N047 N051 {Rin*2}
R7 N051 0 {Rin}
Q5 N015 N019 N027 0 2N3904
Q6 0 BJTQ1 N019 0 2N3906
Q7 0 _CLK N019 0 2N3906
R8 VCC N037 1m
Q8 N037 N041 N047 0 2N3904
Q9 0 _BJTQ1 N041 0 2N3906
Q10 0 _CLK N041 0 2N3906
R9 N037 N041 {Rc_up}
R10 N015 N019 {Rc_up}
Q11 _BJTQ2 N034 0 0 2N3904
D9 N034 _BJTQ2 BAT54
R11 VCC N016 1m
Q12 N016 BJTQ2 N028 0 2N3904
R12 N016 _BJTQ2 {Rout_pull}
R33 N028 N034 {Rin*2}
R34 N034 0 {Rin}
Q33 BJTQ2 N052 0 0 2N3904
D10 N052 BJTQ2 BAT54
Q34 N038 _BJTQ2 N048 0 2N3904
R35 N038 BJTQ2 {Rout_pull}
R36 N048 N052 {Rin*2}
R37 N052 0 {Rin}
Q35 N016 N020 N028 0 2N3904
Q36 0 N022 N020 0 2N3906
Q37 0 CLK N020 0 2N3906
R38 VCC N038 1m
Q38 N038 N042 N048 0 2N3904
Q39 0 N024 N042 0 2N3906
Q40 0 CLK N042 0 2N3906
R39 N038 N042 {Rc_up}
R40 N016 N020 {Rc_up}
Q41 _DATA N030 0 0 2N3904
D11 N030 _DATA BAT54
R42 VCC _DATA {Rout_pull}
Q42 VCC DATA N029 0 2N3904
R47 N029 N030 {Rin*2}
R48 N030 0 {Rin}
Q43 _CLK N044 0 0 2N3904
D12 N044 _CLK BAT54
R41 VCC _CLK {Rout_pull}
Q44 VCC CLK N043 0 2N3904
R43 N043 N044 {Rin*2}
R44 N044 0 {Rin}
.model D D
.lib standard.dio
.model NPN NPN
.model PNP PNP
.lib standard.bjt
.tran {32*reps/freq}
.param VCC=5
.param freq=10mega
.param rise=1n
.param reps=1
* PAR_LD
* PAR_D
* SHIFT
.param Rin=100
.param Rout_pull=300
.param Rin_ld = 1000
.param Rc_up=300
.step temp -25 125 25
.temp 125
.backanno
.end